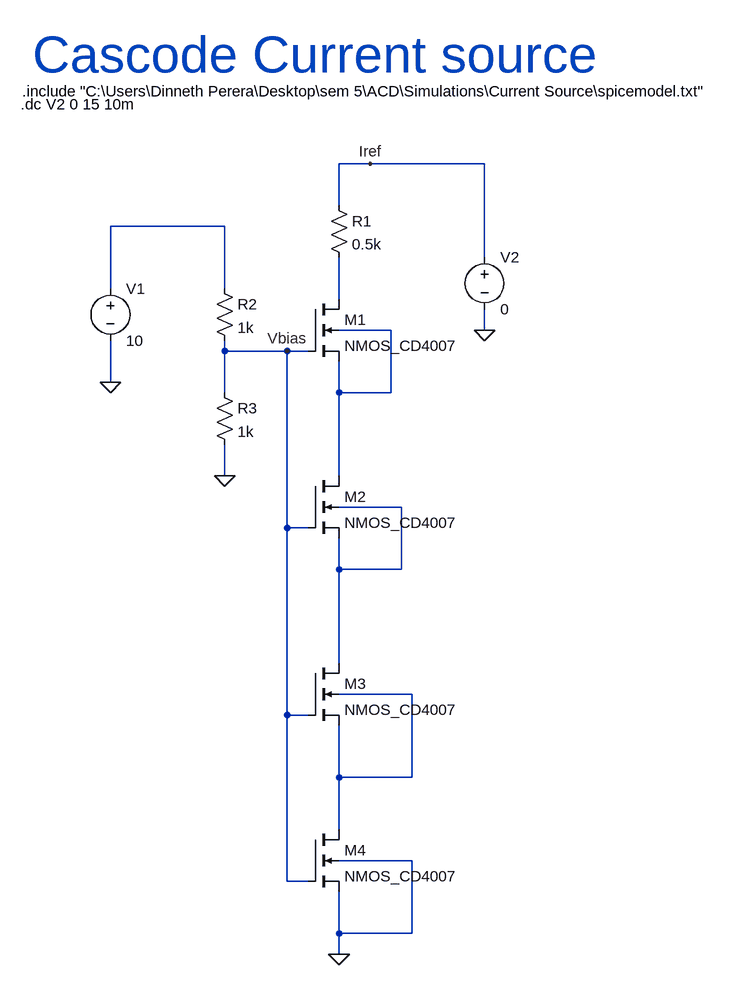
[diagram p0: schematic Cascode nmos current source.asc]
Cascode nmos current source.asc, the LTspice schematic file:
Version 4
SHEET 1 880 1108
WIRE 208 -128 160 -128
WIRE 384 -128 208 -128
WIRE 160 -64 160 -128
WIRE -16 -32 -192 -32
WIRE 384 16 384 -128
WIRE -192 64 -192 -32
WIRE -16 64 -16 -32
WIRE 160 80 160 16
WIRE 240 128 160 128
WIRE 384 128 384 96
WIRE -16 160 -16 144
WIRE 80 160 -16 160
WIRE 112 160 80 160
WIRE -192 208 -192 144
WIRE -16 224 -16 160
WIRE 160 224 160 176
WIRE 240 224 240 128
WIRE 240 224 160 224
WIRE -16 352 -16 304
WIRE 160 352 160 224
WIRE 256 400 160 400
WIRE 80 432 80 160
WIRE 112 432 80 432
WIRE 160 496 160 448
WIRE 256 496 256 400
WIRE 256 496 160 496
WIRE 160 640 160 496
WIRE 272 688 160 688
WIRE 80 720 80 432
WIRE 112 720 80 720
WIRE 160 816 160 736
WIRE 272 816 272 688
WIRE 272 816 160 816
WIRE 160 896 160 816
WIRE 272 944 160 944
WIRE 80 976 80 720
WIRE 112 976 80 976
WIRE 160 1056 160 992
WIRE 272 1056 272 944
WIRE 272 1056 160 1056
WIRE 160 1088 160 1056
FLAG 384 128 0
FLAG -192 208 0
FLAG -16 352 0
FLAG 160 1088 0
FLAG 80 160 Vbias
FLAG 208 -128 Iref
SYMBOL nmos4 112 80 R0
SYMATTR InstName M1
SYMATTR Value NMOS_CD4007
SYMATTR Value2 L=5u W=170u Ad=8500p As=8500p Pd=440u Ps=440u NRD=0.1 NRS=0.1
SYMBOL res 144 -80 R0
SYMATTR InstName R1
SYMATTR Value 0.5k
SYMBOL res -32 48 R0
SYMATTR InstName R2
SYMATTR Value 1k
SYMBOL res -32 208 R0
SYMATTR InstName R3
SYMATTR Value 1k
SYMBOL voltage -192 48 R0
WINDOW 123 0 0 Left 2
WINDOW 39 0 0 Left 2
SYMATTR InstName V1
SYMATTR Value 10
SYMBOL voltage 384 0 R0
WINDOW 123 0 0 Left 2
WINDOW 39 0 0 Left 2
SYMATTR InstName V2
SYMATTR Value 0
SYMBOL nmos4 112 352 R0
SYMATTR InstName M2
SYMATTR Value NMOS_CD4007
SYMATTR Value2 L=5u W=170u Ad=8500p As=8500p Pd=440u Ps=440u NRD=0.1 NRS=0.1
SYMBOL nmos4 112 640 R0
SYMATTR InstName M3
SYMATTR Value NMOS_CD4007
SYMATTR Value2 L=5u W=170u Ad=8500p As=8500p Pd=440u Ps=440u NRD=0.1 NRS=0.1
SYMBOL nmos4 112 896 R0
SYMATTR InstName M4
SYMATTR Value NMOS_CD4007
SYMATTR Value2 L=5u W=170u Ad=8500p As=8500p Pd=440u Ps=440u NRD=0.1 NRS=0.1
TEXT -328 -240 Left 2 !.include "C:\\Users\\Dinneth Perera\\Desktop\\sem 5\\ACD\\Simulations\\Current Source\\spicemodel.txt"
TEXT -330 -220 Left 2 !.dc V2 0 15 10m
TEXT -312 -296 Left 6 ;Cascode Current source

The netlist it stands for:
* Cascode nmos current source.asc
M1 N002 Vbias N003 N003 NMOS_CD4007 L=5u W=170u Ad=8500p As=8500p Pd=440u Ps=440u NRD=0.1 NRS=0.1
R1 Iref N002 0.5k
R2 N001 Vbias 1k
R3 Vbias 0 1k
V1 N001 0 10
V2 Iref 0 0
M2 N003 Vbias N004 N004 NMOS_CD4007 L=5u W=170u Ad=8500p As=8500p Pd=440u Ps=440u NRD=0.1 NRS=0.1
M3 N004 Vbias N005 N005 NMOS_CD4007 L=5u W=170u Ad=8500p As=8500p Pd=440u Ps=440u NRD=0.1 NRS=0.1
M4 N005 Vbias 0 0 NMOS_CD4007 L=5u W=170u Ad=8500p As=8500p Pd=440u Ps=440u NRD=0.1 NRS=0.1
.model NMOS NMOS
.model PMOS PMOS
.lib standard.mos
.include "C:\Users\Dinneth Perera\Desktop\sem 5\ACD\Simulations\Current Source\spicemodel.txt"
.dc V2 0 15 10m
* Cascode Current source
.backanno
.end